# Altium project SPTSquidBoardRev7.PrjPcb
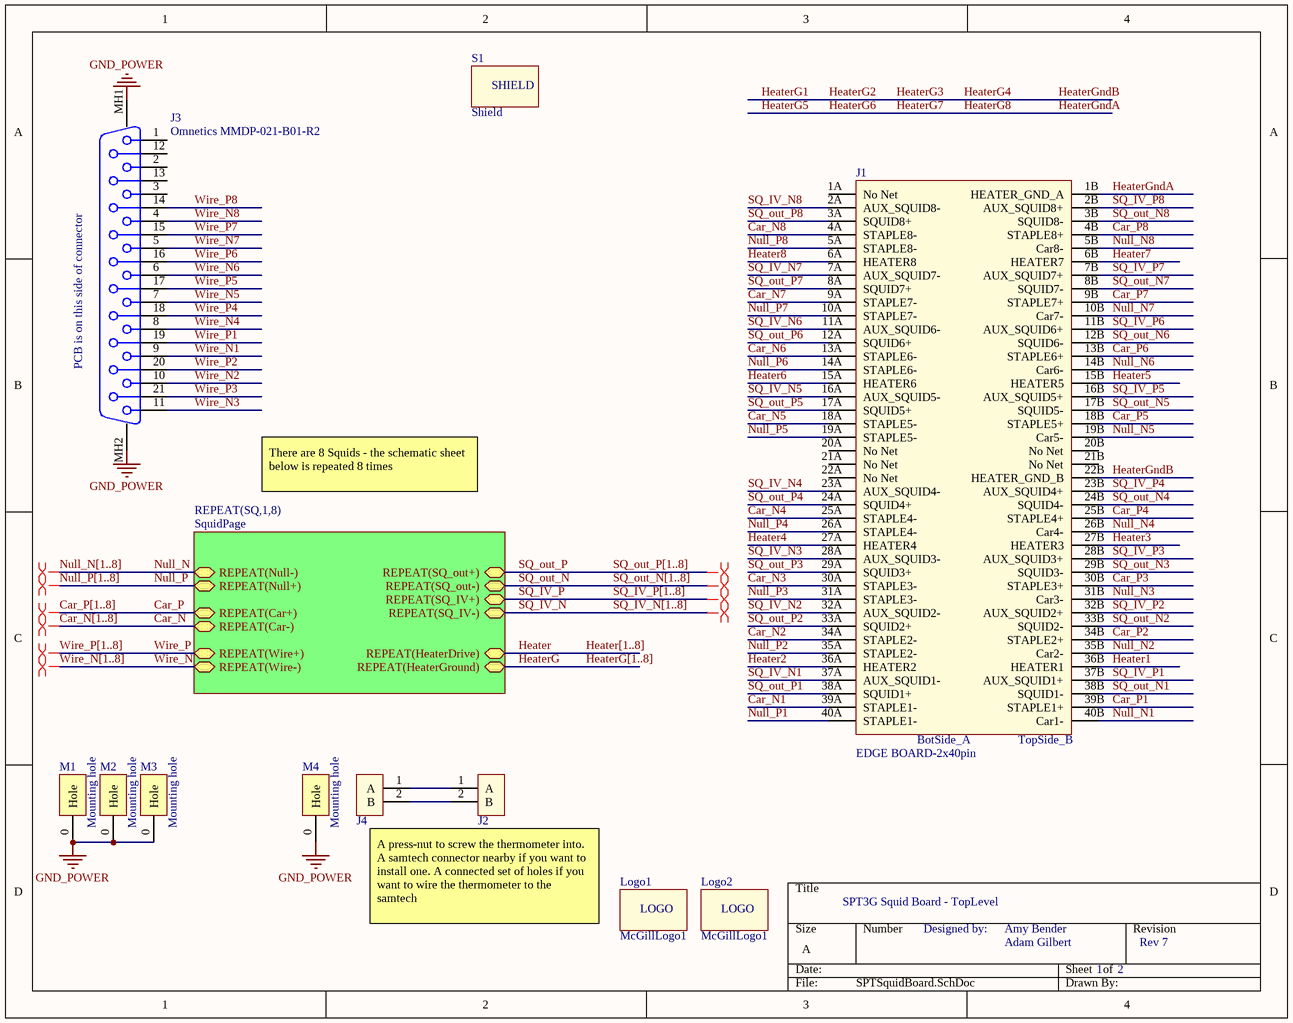
[diagram p0: SPTSquidBoard.SchDoc]
2 sheets, 67 parts. Net scope: hierarchical (ports join the sheet entries above them; power ports are global).
Board file: SPTSquidBoardRev7.PcbDoc
Sheets:
  SPTSquidBoard.SchDoc
    SQ1 = SquidPage.SchDoc
    SQ2 = SquidPage.SchDoc
    SQ3 = SquidPage.SchDoc
    SQ4 = SquidPage.SchDoc
    SQ5 = SquidPage.SchDoc
    SQ6 = SquidPage.SchDoc
    SQ7 = SquidPage.SchDoc
    SQ8 = SquidPage.SchDoc

## Sheet SPTSquidBoard.SchDoc
size A; DocumentNumber: 1; SheetNumber: 1; SheetTotal: 2

### Parts
J1  EDGE BOARD-2x40pin
J2  TempSenseWireConnection  [TempSenseWireCons]  (value not drawn)
J3  Omnetics MMDP-021-B01-R2  [MMDP-021-B02-R2]
J4  TempSenseWireConnection  [TempSenseWireCons]  (value not drawn)
Logo1  McGillLogo1  [McGillLogo1]  (no BOM)
Logo2  McGillLogo1  [McGillLogo1]  (no BOM)
M1  Mounting hole  [MountingHoleSquidBoard]
M2  Mounting hole  [MountingHoleSquidBoard]
M3  Mounting hole  [MountingHoleSquidBoard]
M4  Mounting hole  [MountingHoleSquidBoard]
S1  Shield  [Shield]  (no BOM)

### Sub-sheets
REPEAT(SQ,1,8) = SquidPage: REPEAT(HeaterDrive), REPEAT(SQ_IV+), REPEAT(SQ_IV-), REPEAT(Null-), REPEAT(HeaterGround), REPEAT(Car+), REPEAT(Car-), REPEAT(SQ_out+), REPEAT(SQ_out-), REPEAT(Null+), REPEAT(Wire+), REPEAT(Wire-)

### Nets
GND_POWER: J3.MH1 J3.MH2 M1.0(Hole) M2.0(Hole) M3.0(Hole) M4.0(Hole)
Car_N: sheet REPEAT(SQ,1,8)/REPEAT(Car-)
Car_N1: J1.39A(STAPLE1-)
Car_N2: J1.34A(STAPLE2-)
Car_N3: J1.30A(STAPLE3-)
Car_N4: J1.25A(STAPLE4-)
Car_N5: J1.18A(STAPLE5-)
Car_N6: J1.13A(STAPLE6-)
Car_N7: J1.9A(STAPLE7-)
Car_N8: J1.4A(STAPLE8-)
Car_P: sheet REPEAT(SQ,1,8)/REPEAT(Car+)
Car_P1: J1.39B(STAPLE1+)
Car_P2: J1.34B(STAPLE2+)
Car_P3: J1.30B(STAPLE3+)
Car_P4: J1.25B(STAPLE4+)
Car_P5: J1.18B(STAPLE5+)
Car_P6: J1.13B(STAPLE6+)
Car_P7: J1.9B(STAPLE7+)
Car_P8: J1.4B(STAPLE8+)
Heater: sheet REPEAT(SQ,1,8)/REPEAT(HeaterDrive)
Heater1: J1.36B(HEATER1)
Heater2: J1.36A(HEATER2)
Heater3: J1.27B(HEATER3)
Heater4: J1.27A(HEATER4)
Heater5: J1.15B(HEATER5)
Heater6: J1.15A(HEATER6)
Heater7: J1.6B(HEATER7)
Heater8: J1.6A(HEATER8)
HeaterG: sheet REPEAT(SQ,1,8)/REPEAT(HeaterGround)
HeaterG1: J1.22B(HEATER_GND_B)  [also labelled HeaterG2, HeaterG3, HeaterG4, HeaterGndB]
HeaterG5: J1.1B(HEATER_GND_A)  [also labelled HeaterG6, HeaterG7, HeaterG8, HeaterGndA]
Null_N: sheet REPEAT(SQ,1,8)/REPEAT(Null-)
Null_N1: J1.40B(Car1-)
Null_N2: J1.35B(Car2-)
Null_N3: J1.31B(Car3-)
Null_N4: J1.26B(Car4-)
Null_N5: J1.19B(Car5-)
Null_N6: J1.14B(Car6-)
Null_N7: J1.10B(Car7-)
Null_N8: J1.5B(Car8-)
Null_P: sheet REPEAT(SQ,1,8)/REPEAT(Null+)
Null_P1: J1.40A(STAPLE1-)
Null_P2: J1.35A(STAPLE2-)
Null_P3: J1.31A(STAPLE3-)
Null_P4: J1.26A(STAPLE4-)
Null_P5: J1.19A(STAPLE5-)
Null_P6: J1.14A(STAPLE6-)
Null_P7: J1.10A(STAPLE7-)
Null_P8: J1.5A(STAPLE8-)
SQ_IV_N: sheet REPEAT(SQ,1,8)/REPEAT(SQ_IV-)
SQ_IV_N1: J1.37A(AUX_SQUID1-)
SQ_IV_N2: J1.32A(AUX_SQUID2-)
SQ_IV_N3: J1.28A(AUX_SQUID3-)
SQ_IV_N4: J1.23A(AUX_SQUID4-)
SQ_IV_N5: J1.16A(AUX_SQUID5-)
SQ_IV_N6: J1.11A(AUX_SQUID6-)
SQ_IV_N7: J1.7A(AUX_SQUID7-)
SQ_IV_N8: J1.2A(AUX_SQUID8-)
SQ_IV_P: sheet REPEAT(SQ,1,8)/REPEAT(SQ_IV+)
SQ_IV_P1: J1.37B(AUX_SQUID1+)
SQ_IV_P2: J1.32B(AUX_SQUID2+)
SQ_IV_P3: J1.28B(AUX_SQUID3+)
SQ_IV_P4: J1.23B(AUX_SQUID4+)
SQ_IV_P5: J1.16B(AUX_SQUID5+)
SQ_IV_P6: J1.11B(AUX_SQUID6+)
SQ_IV_P7: J1.7B(AUX_SQUID7+)
SQ_IV_P8: J1.2B(AUX_SQUID8+)
SQ_out_N: sheet REPEAT(SQ,1,8)/REPEAT(SQ_out-)
SQ_out_N1: J1.38B(SQUID1-)
SQ_out_N2: J1.33B(SQUID2-)
SQ_out_N3: J1.29B(SQUID3-)
SQ_out_N4: J1.24B(SQUID4-)
SQ_out_N5: J1.17B(SQUID5-)
SQ_out_N6: J1.12B(SQUID6-)
SQ_out_N7: J1.8B(SQUID7-)
SQ_out_N8: J1.3B(SQUID8-)
SQ_out_P: sheet REPEAT(SQ,1,8)/REPEAT(SQ_out+)
SQ_out_P1: J1.38A(SQUID1+)
SQ_out_P2: J1.33A(SQUID2+)
SQ_out_P3: J1.29A(SQUID3+)
SQ_out_P4: J1.24A(SQUID4+)
SQ_out_P5: J1.17A(SQUID5+)
SQ_out_P6: J1.12A(SQUID6+)
SQ_out_P7: J1.8A(SQUID7+)
SQ_out_P8: J1.3A(SQUID8+)
Wire_N: sheet REPEAT(SQ,1,8)/REPEAT(Wire-)
Wire_N1: J3.9
Wire_N2: J3.10
Wire_N3: J3.11
Wire_N4: J3.8
Wire_N5: J3.7
Wire_N6: J3.6
Wire_N7: J3.5
Wire_N8: J3.4
Wire_P: sheet REPEAT(SQ,1,8)/REPEAT(Wire+)
Wire_P1: J3.19
Wire_P2: J3.20
Wire_P3: J3.21
Wire_P4: J3.18
Wire_P5: J3.17
Wire_P6: J3.16
Wire_P7: J3.15
Wire_P8: J3.14
NetJ2_1: J2.1(A) J4.1(A)
NetJ2_2: J2.2(B) J4.2(B)

Not connected (* = marked no-connect by the designer): J1 1A(No_Net) 20A(No_Net) 20B(No_Net) 21A(No_Net) 21B(No_Net) 22A(No_Net); J3 1 2 3 12 13

### Buses and harness runs
bus Car_N[1..8]
bus Car_P[1..8]
bus Heater[1..8]
bus HeaterG[1..8]
bus Null_N[1..8]
bus Null_P[1..8]
bus SQ_IV_N[1..8]
bus SQ_IV_P[1..8]
bus SQ_out_N[1..8]
bus SQ_out_P[1..8]
bus Wire_N[1..8]
bus Wire_P[1..8]

### Layout directives
differential pair: (no net found under the mark)

### Notes on the sheet
- (near J3) PCB is on this side of connector
- There are 8 Squids - the schematic sheet below is repeated 8 times
- SPT3G Squid Board - TopLevel
- A press-nut to screw the thermometer into.
  A samtech connector nearby if you want to install one. A connected set of holes if you want to wire the thermometer to the samtech
- Designed by:
- Adam Gilbert
- Amy Bender
- 1     2
- Rev 7
- (in symbol EDGE BOARD-2x40pin) BotSide_A; TopSide_B
- (in symbol Logo) LOGO
- (in symbol Shield) SHIELD

### Library data of the parts
J1 = EDGE BOARD-2x40pin: Edge connector
J2 J4 = TempSenseCon
J3 = OmneticsMicroD21
Logo1 Logo2 = Logo
M1-M4 = SquidBoardMountingHole

## Sheet SquidPage.SchDoc
size A; DocumentNumber: 2; SheetNumber: 2; SheetTotal: 2
Used 8 times, as channels SQ1, SQ2, SQ3, SQ4, SQ5, SQ6, SQ7, SQ8. Parts and nets are listed once, with the designators drawn on the sheet.
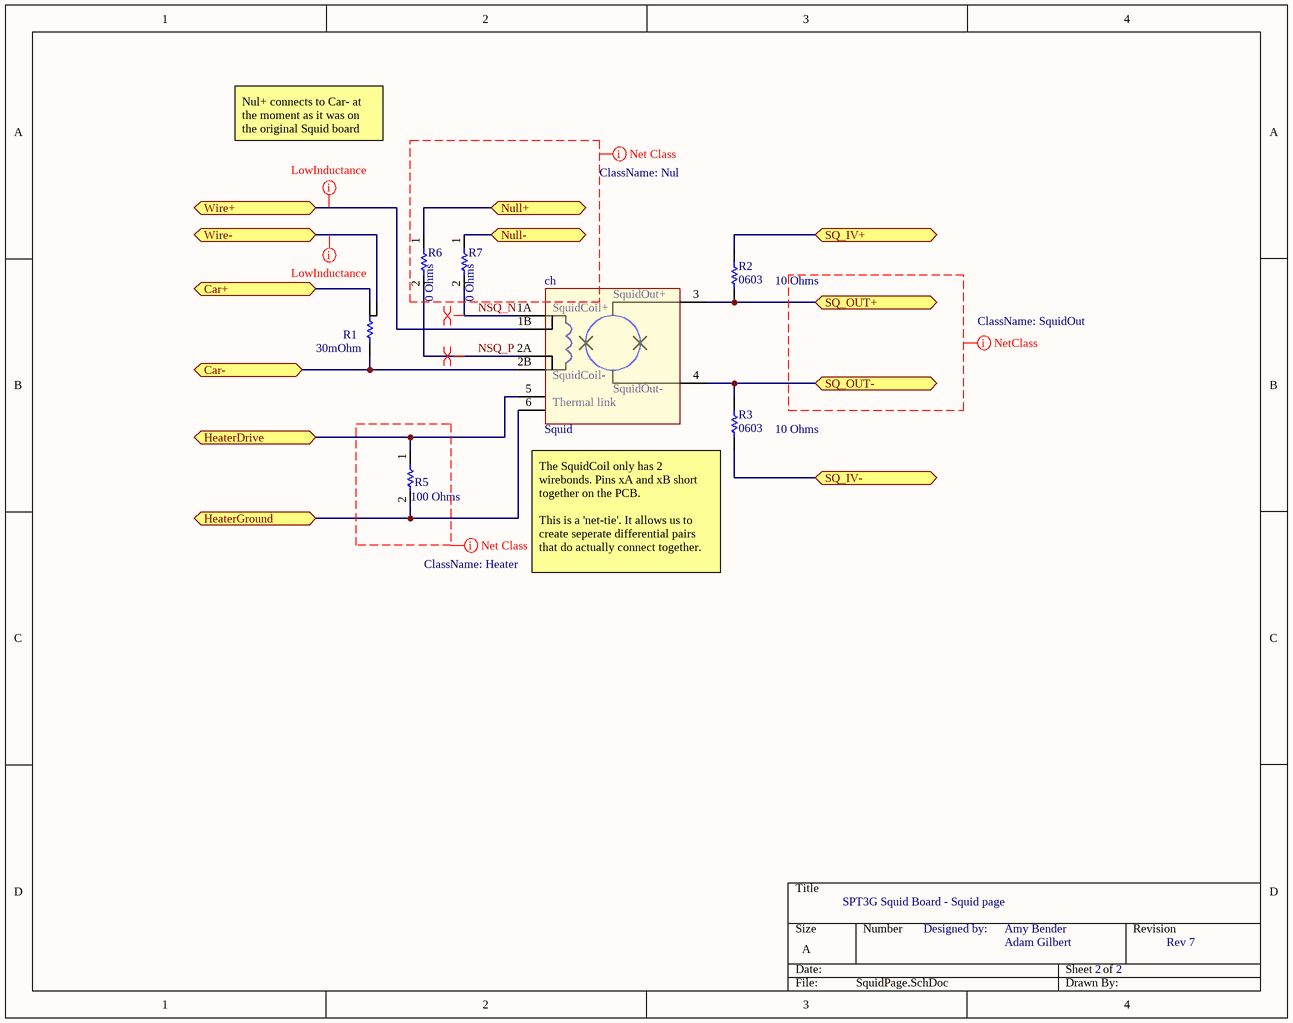
[diagram p1: SquidPage.SchDoc]

### Parts
ch  Squid  [Squid]  (net tie)
R1  value 30mOhm  [0805NetTie]  (hidden comment: ResBias)  (net tie, no BOM)
R2  0603  value 10 Ohms  [0603]
R3  0603  value 10 Ohms  [0603]
R5  value 100 Ohms  [0603-NoSilk]  (hidden comment: ResSquidBoard)
R6  value 0 Ohms  [0603]  (hidden comment: ResSquidBoard)
R7  value 0 Ohms  [0603]  (hidden comment: ResSquidBoard)

### Ports
Car+, Car-, HeaterDrive, HeaterGround, Null+, Null-, SQ_IV+, SQ_IV-, SQ_OUT+, SQ_OUT-, Wire+, Wire-

### Nets
Car+: R1.2A ; port Car+
Car-: ch.2B(SquidCoil-) R1.1 ; port Car-
HeaterDrive: ch.5(Heater) R5.1 ; port HeaterDrive
HeaterGround: ch.6(HeaterGnd) R5.2 ; port HeaterGround
NSQ_N: ch.1A(SquidCoil+) R7.2
NSQ_P: ch.2A(SquidCoil-) R6.2
Null+: R6.1 ; port Null+
Null-: R7.1 ; port Null-
SQ_IV+: R2.2 ; port SQ_IV+
SQ_IV-: R3.1 ; port SQ_IV-
SQ_OUT+: ch.3(SQUID+) R2.1 ; port SQ_OUT+
SQ_OUT-: ch.4(SQUID-) R3.2 ; port SQ_OUT-
Wire+: ch.1B(SquidCoil+) ; port Wire+
Wire-: R1.2B ; port Wire-

### Channels
SQ1: designators end in SQ1; ports Car+=Car_P1 Car-=Car_N1 HeaterDrive=Heater1 HeaterGround=HeaterG1 Null+=Null_P1 Null-=Null_N1 SQ_IV+=SQ_IV_P1 SQ_IV-=SQ_IV_N1 SQ_OUT+=SQ_out_P1 SQ_OUT-=SQ_out_N1 Wire+=Wire_P1 Wire-=Wire_N1
SQ2: designators end in SQ2; ports Car+=Car_P2 Car-=Car_N2 HeaterDrive=Heater2 HeaterGround=HeaterG1 Null+=Null_P2 Null-=Null_N2 SQ_IV+=SQ_IV_P2 SQ_IV-=SQ_IV_N2 SQ_OUT+=SQ_out_P2 SQ_OUT-=SQ_out_N2 Wire+=Wire_P2 Wire-=Wire_N2
SQ3: designators end in SQ3; ports Car+=Car_P3 Car-=Car_N3 HeaterDrive=Heater3 HeaterGround=HeaterG1 Null+=Null_P3 Null-=Null_N3 SQ_IV+=SQ_IV_P3 SQ_IV-=SQ_IV_N3 SQ_OUT+=SQ_out_P3 SQ_OUT-=SQ_out_N3 Wire+=Wire_P3 Wire-=Wire_N3
SQ4: designators end in SQ4; ports Car+=Car_P4 Car-=Car_N4 HeaterDrive=Heater4 HeaterGround=HeaterG1 Null+=Null_P4 Null-=Null_N4 SQ_IV+=SQ_IV_P4 SQ_IV-=SQ_IV_N4 SQ_OUT+=SQ_out_P4 SQ_OUT-=SQ_out_N4 Wire+=Wire_P4 Wire-=Wire_N4
SQ5: designators end in SQ5; ports Car+=Car_P5 Car-=Car_N5 HeaterDrive=Heater5 HeaterGround=HeaterG5 Null+=Null_P5 Null-=Null_N5 SQ_IV+=SQ_IV_P5 SQ_IV-=SQ_IV_N5 SQ_OUT+=SQ_out_P5 SQ_OUT-=SQ_out_N5 Wire+=Wire_P5 Wire-=Wire_N5
SQ6: designators end in SQ6; ports Car+=Car_P6 Car-=Car_N6 HeaterDrive=Heater6 HeaterGround=HeaterG5 Null+=Null_P6 Null-=Null_N6 SQ_IV+=SQ_IV_P6 SQ_IV-=SQ_IV_N6 SQ_OUT+=SQ_out_P6 SQ_OUT-=SQ_out_N6 Wire+=Wire_P6 Wire-=Wire_N6
SQ7: designators end in SQ7; ports Car+=Car_P7 Car-=Car_N7 HeaterDrive=Heater7 HeaterGround=HeaterG5 Null+=Null_P7 Null-=Null_N7 SQ_IV+=SQ_IV_P7 SQ_IV-=SQ_IV_N7 SQ_OUT+=SQ_out_P7 SQ_OUT-=SQ_out_N7 Wire+=Wire_P7 Wire-=Wire_N7
SQ8: designators end in SQ8; ports Car+=Car_P8 Car-=Car_N8 HeaterDrive=Heater8 HeaterGround=HeaterG5 Null+=Null_P8 Null-=Null_N8 SQ_IV+=SQ_IV_P8 SQ_IV-=SQ_IV_N8 SQ_OUT+=SQ_out_P8 SQ_OUT-=SQ_out_N8 Wire+=Wire_P8 Wire-=Wire_N8

### Layout directives
net class Heater: (no net found under the mark)
net class SquidOut: (no net found under the mark)
net class Nul: (no net found under the mark)
net class LowInductance: Wire_N1, Wire_P1
differential pair: NSQ_N_SQ1, NSQ_P_SQ1

### Notes on the sheet
- Nul+ connects to Car- at the moment as it was on the original Squid board
- (near R3) The SquidCoil only has 2 wirebonds. Pins xA and xB short together on the PCB.
  This is a 'net-tie'. It allows us to create seperate differential pairs that do actually connect together.
- SPT3G Squid Board - Squid page
- Designed by:
- Adam Gilbert
- Amy Bender
- 2     2
- Rev 7
- (in symbol Squid) SquidOut+; SquidOut-; Thermal link

### Library data of the parts
R1 = ResBias: Resistor
R2 R3 = Res0603: RES 1 OHM 1/10W 1% 0603 SMD; TechInfo: *
R5-R7 = ResSquidBoard: Resistor

## Nets that join several sheets
Car_N1: SPTSquidBoard (J1.39A), SQ1 (chSQ1.2B R1SQ1.1)
Car_N2: SPTSquidBoard (J1.34A), SQ2 (chSQ2.2B R1SQ2.1)
Car_N3: SPTSquidBoard (J1.30A), SQ3 (chSQ3.2B R1SQ3.1)
Car_N4: SPTSquidBoard (J1.25A), SQ4 (chSQ4.2B R1SQ4.1)
Car_N5: SPTSquidBoard (J1.18A), SQ5 (chSQ5.2B R1SQ5.1)
Car_N6: SPTSquidBoard (J1.13A), SQ6 (chSQ6.2B R1SQ6.1)
Car_N7: SPTSquidBoard (J1.9A), SQ7 (chSQ7.2B R1SQ7.1)
Car_N8: SPTSquidBoard (J1.4A), SQ8 (chSQ8.2B R1SQ8.1)
Car_P1: SPTSquidBoard (J1.39B), SQ1 (R1SQ1.2A)
Car_P2: SPTSquidBoard (J1.34B), SQ2 (R1SQ2.2A)
Car_P3: SPTSquidBoard (J1.30B), SQ3 (R1SQ3.2A)
Car_P4: SPTSquidBoard (J1.25B), SQ4 (R1SQ4.2A)
Car_P5: SPTSquidBoard (J1.18B), SQ5 (R1SQ5.2A)
Car_P6: SPTSquidBoard (J1.13B), SQ6 (R1SQ6.2A)
Car_P7: SPTSquidBoard (J1.9B), SQ7 (R1SQ7.2A)
Car_P8: SPTSquidBoard (J1.4B), SQ8 (R1SQ8.2A)
Heater1: SPTSquidBoard (J1.36B), SQ1 (chSQ1.5 R5SQ1.1)
Heater2: SPTSquidBoard (J1.36A), SQ2 (chSQ2.5 R5SQ2.1)
Heater3: SPTSquidBoard (J1.27B), SQ3 (chSQ3.5 R5SQ3.1)
Heater4: SPTSquidBoard (J1.27A), SQ4 (chSQ4.5 R5SQ4.1)
Heater5: SPTSquidBoard (J1.15B), SQ5 (chSQ5.5 R5SQ5.1)
Heater6: SPTSquidBoard (J1.15A), SQ6 (chSQ6.5 R5SQ6.1)
Heater7: SPTSquidBoard (J1.6B), SQ7 (chSQ7.5 R5SQ7.1)
Heater8: SPTSquidBoard (J1.6A), SQ8 (chSQ8.5 R5SQ8.1)
HeaterG1: SPTSquidBoard (J1.22B), SQ1 (chSQ1.6 R5SQ1.2), SQ2 (chSQ2.6 R5SQ2.2), SQ3 (chSQ3.6 R5SQ3.2), SQ4 (chSQ4.6 R5SQ4.2)
HeaterG5: SPTSquidBoard (J1.1B), SQ5 (chSQ5.6 R5SQ5.2), SQ6 (chSQ6.6 R5SQ6.2), SQ7 (chSQ7.6 R5SQ7.2), SQ8 (chSQ8.6 R5SQ8.2)
Null_N1: SPTSquidBoard (J1.40B), SQ1 (R7SQ1.1)
Null_N2: SPTSquidBoard (J1.35B), SQ2 (R7SQ2.1)
Null_N3: SPTSquidBoard (J1.31B), SQ3 (R7SQ3.1)
Null_N4: SPTSquidBoard (J1.26B), SQ4 (R7SQ4.1)
Null_N5: SPTSquidBoard (J1.19B), SQ5 (R7SQ5.1)
Null_N6: SPTSquidBoard (J1.14B), SQ6 (R7SQ6.1)
Null_N7: SPTSquidBoard (J1.10B), SQ7 (R7SQ7.1)
Null_N8: SPTSquidBoard (J1.5B), SQ8 (R7SQ8.1)
Null_P1: SPTSquidBoard (J1.40A), SQ1 (R6SQ1.1)
Null_P2: SPTSquidBoard (J1.35A), SQ2 (R6SQ2.1)
Null_P3: SPTSquidBoard (J1.31A), SQ3 (R6SQ3.1)
Null_P4: SPTSquidBoard (J1.26A), SQ4 (R6SQ4.1)
Null_P5: SPTSquidBoard (J1.19A), SQ5 (R6SQ5.1)
Null_P6: SPTSquidBoard (J1.14A), SQ6 (R6SQ6.1)
Null_P7: SPTSquidBoard (J1.10A), SQ7 (R6SQ7.1)
Null_P8: SPTSquidBoard (J1.5A), SQ8 (R6SQ8.1)
SQ_IV_N1: SPTSquidBoard (J1.37A), SQ1 (R3SQ1.1)
SQ_IV_N2: SPTSquidBoard (J1.32A), SQ2 (R3SQ2.1)
SQ_IV_N3: SPTSquidBoard (J1.28A), SQ3 (R3SQ3.1)
SQ_IV_N4: SPTSquidBoard (J1.23A), SQ4 (R3SQ4.1)
SQ_IV_N5: SPTSquidBoard (J1.16A), SQ5 (R3SQ5.1)
SQ_IV_N6: SPTSquidBoard (J1.11A), SQ6 (R3SQ6.1)
SQ_IV_N7: SPTSquidBoard (J1.7A), SQ7 (R3SQ7.1)
SQ_IV_N8: SPTSquidBoard (J1.2A), SQ8 (R3SQ8.1)
SQ_IV_P1: SPTSquidBoard (J1.37B), SQ1 (R2SQ1.2)
SQ_IV_P2: SPTSquidBoard (J1.32B), SQ2 (R2SQ2.2)
SQ_IV_P3: SPTSquidBoard (J1.28B), SQ3 (R2SQ3.2)
SQ_IV_P4: SPTSquidBoard (J1.23B), SQ4 (R2SQ4.2)
SQ_IV_P5: SPTSquidBoard (J1.16B), SQ5 (R2SQ5.2)
SQ_IV_P6: SPTSquidBoard (J1.11B), SQ6 (R2SQ6.2)
SQ_IV_P7: SPTSquidBoard (J1.7B), SQ7 (R2SQ7.2)
SQ_IV_P8: SPTSquidBoard (J1.2B), SQ8 (R2SQ8.2)
SQ_out_N1: SPTSquidBoard (J1.38B), SQ1 (chSQ1.4 R3SQ1.2)
SQ_out_N2: SPTSquidBoard (J1.33B), SQ2 (chSQ2.4 R3SQ2.2)
SQ_out_N3: SPTSquidBoard (J1.29B), SQ3 (chSQ3.4 R3SQ3.2)
SQ_out_N4: SPTSquidBoard (J1.24B), SQ4 (chSQ4.4 R3SQ4.2)
SQ_out_N5: SPTSquidBoard (J1.17B), SQ5 (chSQ5.4 R3SQ5.2)
SQ_out_N6: SPTSquidBoard (J1.12B), SQ6 (chSQ6.4 R3SQ6.2)
SQ_out_N7: SPTSquidBoard (J1.8B), SQ7 (chSQ7.4 R3SQ7.2)
SQ_out_N8: SPTSquidBoard (J1.3B), SQ8 (chSQ8.4 R3SQ8.2)
SQ_out_P1: SPTSquidBoard (J1.38A), SQ1 (chSQ1.3 R2SQ1.1)
SQ_out_P2: SPTSquidBoard (J1.33A), SQ2 (chSQ2.3 R2SQ2.1)
SQ_out_P3: SPTSquidBoard (J1.29A), SQ3 (chSQ3.3 R2SQ3.1)
SQ_out_P4: SPTSquidBoard (J1.24A), SQ4 (chSQ4.3 R2SQ4.1)
SQ_out_P5: SPTSquidBoard (J1.17A), SQ5 (chSQ5.3 R2SQ5.1)
SQ_out_P6: SPTSquidBoard (J1.12A), SQ6 (chSQ6.3 R2SQ6.1)
SQ_out_P7: SPTSquidBoard (J1.8A), SQ7 (chSQ7.3 R2SQ7.1)
SQ_out_P8: SPTSquidBoard (J1.3A), SQ8 (chSQ8.3 R2SQ8.1)
Wire_N1: SPTSquidBoard (J3.9), SQ1 (R1SQ1.2B)
Wire_N2: SPTSquidBoard (J3.10), SQ2 (R1SQ2.2B)
Wire_N3: SPTSquidBoard (J3.11), SQ3 (R1SQ3.2B)
Wire_N4: SPTSquidBoard (J3.8), SQ4 (R1SQ4.2B)
Wire_N5: SPTSquidBoard (J3.7), SQ5 (R1SQ5.2B)
Wire_N6: SPTSquidBoard (J3.6), SQ6 (R1SQ6.2B)
Wire_N7: SPTSquidBoard (J3.5), SQ7 (R1SQ7.2B)
Wire_N8: SPTSquidBoard (J3.4), SQ8 (R1SQ8.2B)
Wire_P1: SPTSquidBoard (J3.19), SQ1 (chSQ1.1B)
Wire_P2: SPTSquidBoard (J3.20), SQ2 (chSQ2.1B)
Wire_P3: SPTSquidBoard (J3.21), SQ3 (chSQ3.1B)
Wire_P4: SPTSquidBoard (J3.18), SQ4 (chSQ4.1B)
Wire_P5: SPTSquidBoard (J3.17), SQ5 (chSQ5.1B)
Wire_P6: SPTSquidBoard (J3.16), SQ6 (chSQ6.1B)
Wire_P7: SPTSquidBoard (J3.15), SQ7 (chSQ7.1B)
Wire_P8: SPTSquidBoard (J3.14), SQ8 (chSQ8.1B)